# EAGLE schematic ChronoCape (EAGLE 7.5.0)
REV: A

## Sheet 1 of 2
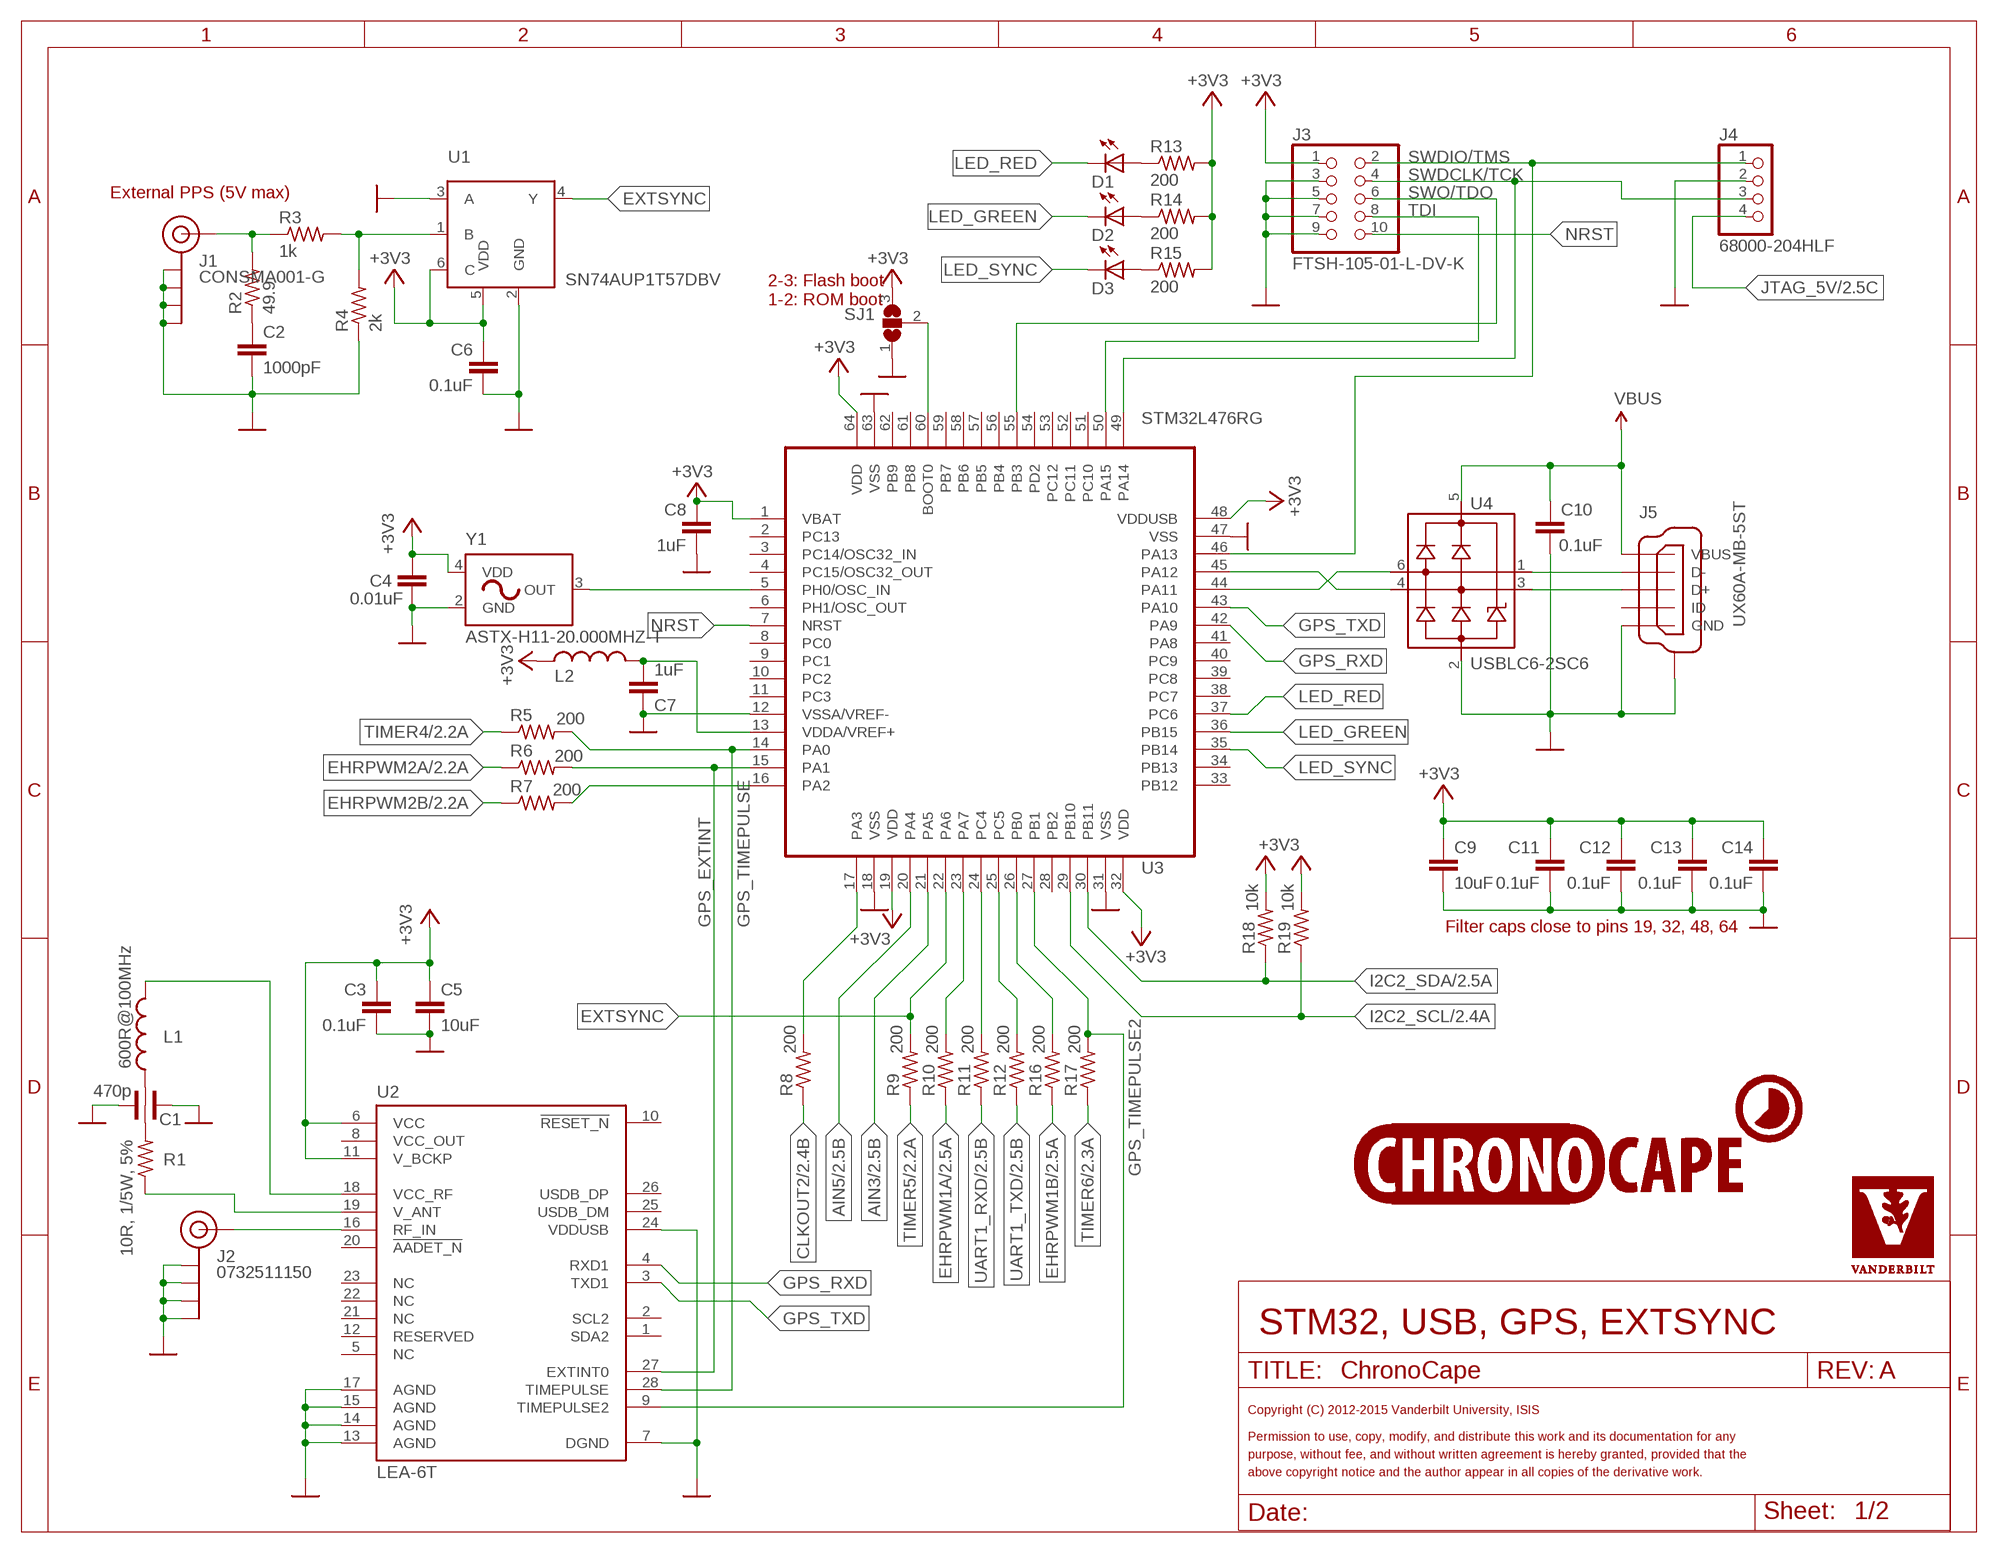
[diagram p0: schematic, sheet 1]

### Parts
C1  470p  CTHROUGH0805  [CTHROUGH0805]
C2  1000pF  C0603  [CHIP0603]
C3  0.1uF  C0603  [CHIP0603]
C4  0.01uF  C0603  [CHIP0603]
C5  10uF  C0805  [CHIP0805]
C6  0.1uF  C0603  [CHIP0603]
C7  1uF  C0603  [CHIP0603]
C8  1uF  C0603  [CHIP0603]
C9  10uF  C0805  [CHIP0805]
C10  0.1uF  C0603  [CHIP0603]
C11  0.1uF  C0603  [CHIP0603]
C12  0.1uF  C0603  [CHIP0603]
C13  0.1uF  C0603  [CHIP0603]
C14  0.1uF  C0603  [CHIP0603]
D1  598-8010-107F  LED0603  [D0603]
D2  598-8070-107F  LED0603  [D0603]
D3  598-8030-107F  LED0603  [D0603]
J1  CONSMA001-G  SMA_THROUGH  [SMA-THROUGH]
J2  0732511150  SMA_EDGE  [SMA-EDGE]
J3  FTSH-105-01-L-DV-K  [FTSH-105-01-L-DV-K]
J4  68000-204HLF  PINHD-1X4  [1X04]
J5  UX60A-MB-5ST  [UX60A-MB-5ST]
L1  600R@100MHz  L0603  [CHIP0603]
L2  BKP1608HS330  L0603  [CHIP0603]
LOGO1  LOGO_CHRONOCAPE  [LOGO_CHRONOSCAPE]
LOGO2  LOGO_VANDERBILT280MIL  [LOGO_VANDERBILT_280MIL]
R1  10R, 1/5W, 5%  R0603  [CHIP0603]
R2  49.9  R0603  [CHIP0603]
R3  1k  R0603  [CHIP0603]
R4  2k  R0603  [CHIP0603]
R5  200  R0603  [CHIP0603]
R6  200  R0603  [CHIP0603]
R7  200  R0603  [CHIP0603]
R8  200  R0603  [CHIP0603]
R9  200  R0603  [CHIP0603]
R10  200  R0603  [CHIP0603]
R11  200  R0603  [CHIP0603]
R12  200  R0603  [CHIP0603]
R13  200  R0603  [CHIP0603]
R14  200  R0603  [CHIP0603]
R15  200  R0603  [CHIP0603]
R16  200  R0603  [CHIP0603]
R17  200  R0603  [CHIP0603]
R18  10k  R0603  [CHIP0603]
R19  10k  R0603  [CHIP0603]
SJ1  SOLDERJUMPER_2WAYPASTE1&2  [SJ_3_PASTE1&2]
U1  SN74AUP1T57DBV  [SOT23-6]
U2  LEA-6T  [LEA-6]
U3  STM32L476RG  [LQFP64]
U4  USBLC6-2SC6  [SOT23-6L]
Y1  ASTX-H11-20.000MHZ-T  OSC_ASTX-H11  [SMD_3.2X2.5]

### Nets
+3V3 [power]: C3.1 C4.1 C5.1 C6.1 C8.1 C9.1 C11.1 C12.1 C13.1 C14.1 J3.1 L2.2 R13.2 R14.2 R15.2 R18.2 R19.2 SJ1.3 U1.5(VDD) U1.6(C) U2.6(VCC) U2.11(V_BCKP) U3.1(VBAT) U3.19(VDD) U3.32(VDD) U3.48(VDDUSB) U3.64(VDD) Y1.4(VDD) ; also sheet 2
AIN3: U3.21(PA5) ; also sheet 2
AIN5: U3.20(PA4) ; also sheet 2
CLKOUT2: R8.1 ; also sheet 2
EHRPWM1A: R10.1 ; also sheet 2
EHRPWM1B: R16.1 ; also sheet 2
EHRPWM2A: R6.1 ; also sheet 2
EHRPWM2B: R7.1 ; also sheet 2
EXTSYNC: R9.2 U1.4(Y) U3.22(PA6)
GND [power]: C1.GND$1(GND) C1.GND$2(GND) C2.2 C3.2 C4.2 C5.2 C6.2 C7.1 C8.2 C9.2 C10.2 C11.2 C12.2 C13.2 C14.2 J1.GND@0(GND) J1.GND@1(GND) J1.GND@2(GND) J1.GND@3(GND) J2.GND@0(GND) J2.GND@1(GND) J2.GND@2(GND) J2.GND@3(GND) J3.3 J3.5 J3.7 J3.9 J4.2 J5.5(GND) J5.SHLD@1(SHLD) J5.SHLD@2(SHLD) J5.SHLD@3(SHLD) J5.SHLD@4(SHLD) R4.1 SJ1.1 U1.2(GND) U1.3(A) U2.7(DGND) U2.13(AGND) U2.14(AGND) U2.15(AGND) U2.17(AGND) U2.24(VDDUSB) U3.12(VSSA/VREF-) U3.18(VSS) U3.31(VSS) U3.47(VSS) U3.63(VSS) U4.2(GND) Y1.2(GND) ; also sheet 2
GPS_EXTINT: R6.2 U2.27(EXTINT0) U3.15(PA1)
GPS_RXD: U2.4(RXD1) U3.42(PA9)
GPS_TIMEPULSE: R5.2 U2.28(TIMEPULSE) U3.14(PA0)
GPS_TIMEPULSE2: R17.2 U2.9(TIMEPULSE2) U3.27(PB1)
GPS_TXD: U2.3(TXD1) U3.43(PA10)
I2C2_SCL: R19.1 U3.29(PB10) ; also sheet 2
I2C2_SDA: R18.1 U3.30(PB11) ; also sheet 2
JTAG_5V [power]: J4.4 ; also sheet 2
LED_GREEN: D2.1(C) U3.36(PB15)
LED_RED: D1.1(C) U3.37(PC6)
LED_SYNC: D3.1(C) U3.35(PB14)
N$1: C2.1 R2.1
N$2: J1.SIG(SIGNAL) R2.2 R3.1
N$3 [power]: C7.2 L2.1 U3.13(VDDA/VREF+)
N$4: R3.2 R4.2 U1.1(B)
N$6: D1.2(A) R13.1
N$7: D2.2(A) R14.1
N$8 [power]: L1.2 U2.18(VCC_RF)
N$10: D3.2(A) R15.1
N$11: J2.SIG(SIGNAL) U2.16(RF_IN)
N$12: C1.2 L1.1
N$13 [power]: R1.1 U2.19(V_ANT)
N$14: C1.1 R1.2
N$15: J5.2(D-) U4.1(IO1)
N$18: SJ1.2 U3.60(BOOT0)
N$24: J5.3(D+) U4.3(IO2)
N$28: R7.2 U3.16(PA2)
N$30: R10.2 U3.23(PA7)
N$31: R11.2 U3.24(PC4)
N$32: R12.2 U3.25(PC5)
N$33: R16.2 U3.26(PB0)
N$35: R8.2 U3.17(PA3)
NRST: J3.10 U3.7(NRST)
OUT: U3.5(PH0/OSC_IN) Y1.3(OUT)
SWDCLK/TCK: J3.4 J4.3 U3.49(PA14)
SWDIO/TMS: J3.2 J4.1 U3.46(PA13)
SWO/TDO: J3.6 U3.55(PB3)
TDI: J3.8 U3.50(PA15)
TIMER4: R5.1 ; also sheet 2
TIMER5: R9.1 ; also sheet 2
TIMER6: R17.1 ; also sheet 2
UART1_RXD: R11.1 ; also sheet 2
UART1_TXD: R12.1 ; also sheet 2
USB_DM: U3.44(PA11) U4.6(IO1)
USB_DP: U3.45(PA12) U4.4(IO2)
VBUS [power]: C10.1 J5.1(VBUS) U4.5(VBUS) ; also sheet 2
Unconnected: J5.4(ID) U2.1(SDA2) U2.2(SCL2) U2.5(NC) U2.10(!RESET_N) U2.12(RESERVED) U2.20(!AADET_N) U2.21(NC) U2.22(NC) U2.23(NC) U2.25(USDB_DM) U2.26(USDB_DP) U3.2(PC13) U3.3(PC14/OSC32_IN) U3.4(PC15/OSC32_OUT) U3.6(PH1/OSC_OUT) U3.8(PC0) U3.9(PC1) U3.10(PC2) U3.11(PC3) U3.28(PB2) U3.33(PB12) U3.34(PB13) U3.38(PC7) U3.39(PC8) U3.40(PC9) U3.41(PA8) U3.51(PC10) U3.52(PC11) U3.53(PC12) U3.54(PD2) U3.56(PB4) U3.57(PB5) U3.58(PB6) U3.59(PB7) U3.61(PB8) U3.62(PB9)

### Notes on the sheet
- External PPS (5V max)
- 2-3: Flash boot
  1-2: ROM boot
- Filter caps close to pins 19, 32, 48, 64
- STM32, USB, GPS, EXTSYNC

## Sheet 2 of 2
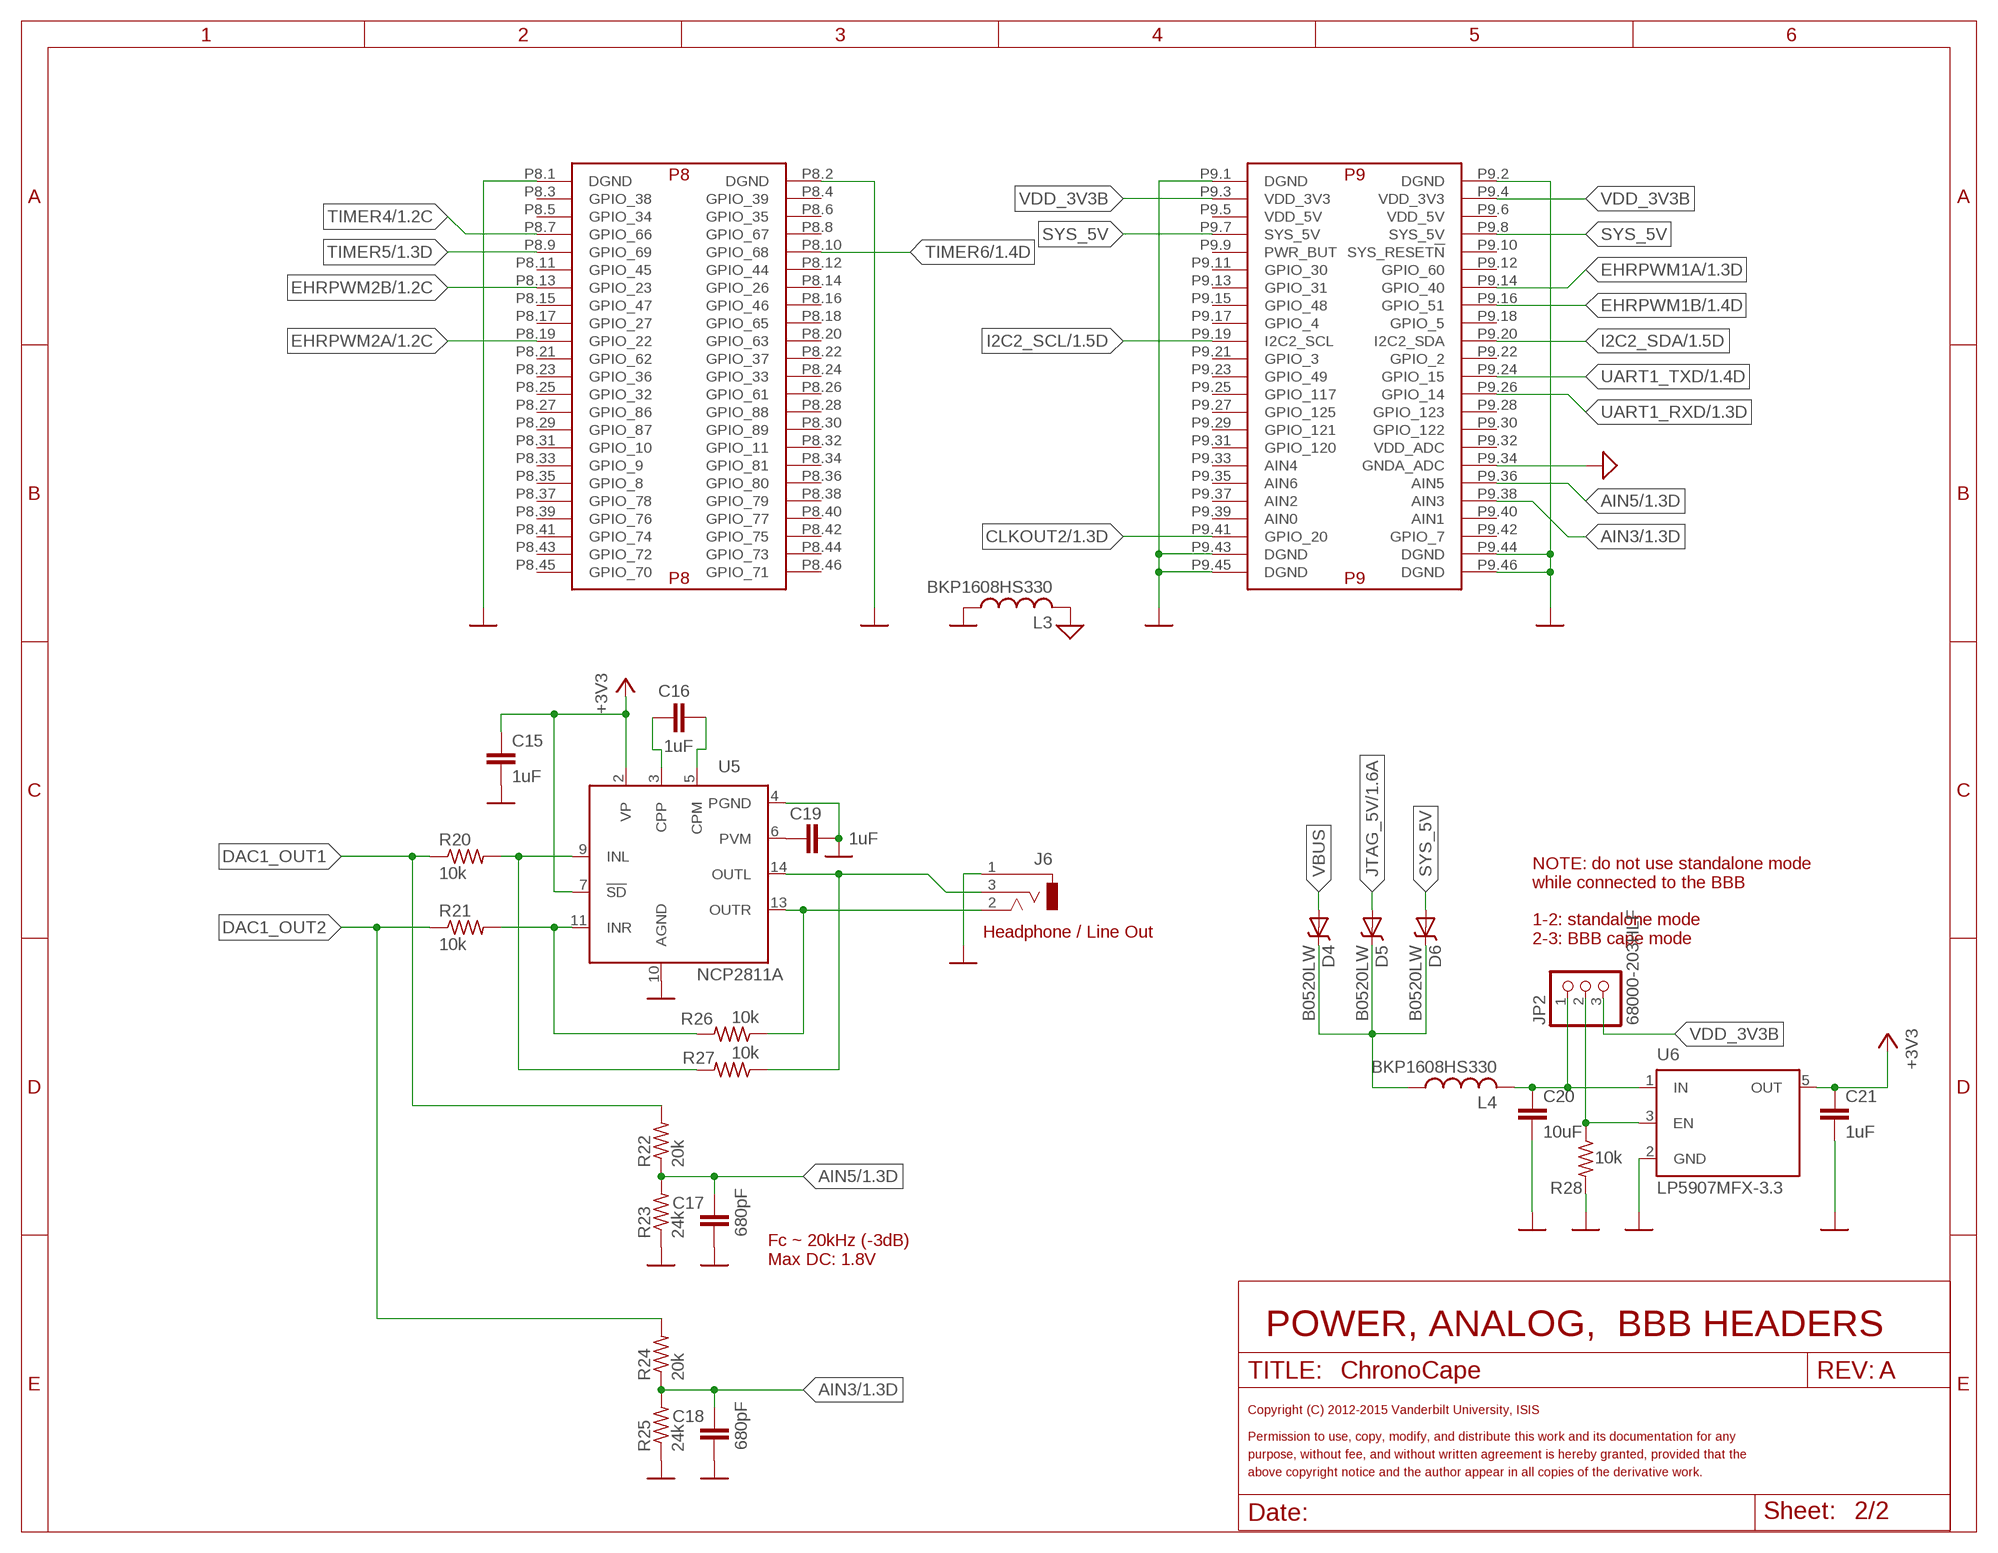
[diagram p1: schematic, sheet 2]

### Parts
BBB1  BEAGLE_BONE_BLACK_CAPE  [BEAGLE_BONE_BLACK_CAPE]
C15  1uF  C0603  [CHIP0603]
C16  1uF  C0603  [CHIP0603]
C17  680pF  C0603  [CHIP0603]
C18  680pF  C0603  [CHIP0603]
C19  1uF  C0603  [CHIP0603]
C20  10uF  C0805  [CHIP0805]
C21  1uF  C0603  [CHIP0603]
D4  B0520LW  DIODE-SCHOTTKYSOD-123  [SOD-123]
D5  B0520LW  DIODE-SCHOTTKYSOD-123  [SOD-123]
D6  B0520LW  DIODE-SCHOTTKYSOD-123  [SOD-123]
J6  CON_STEREO_JACK_SJ-3523-SMT  [SJ-3523-SMT]
JP2  68000-203HLF  PINHD-1X3  [1X03]
L3  BKP1608HS330  L0603  [CHIP0603]
L4  BKP1608HS330  L0603  [CHIP0603]
R20  10k  R0603  [CHIP0603]
R21  10k  R0603  [CHIP0603]
R22  20k  R0603  [CHIP0603]
R23  24k  R0603  [CHIP0603]
R24  20k  R0603  [CHIP0603]
R25  24k  R0603  [CHIP0603]
R26  10k  R0603  [CHIP0603]
R27  10k  R0603  [CHIP0603]
R28  10k  R0603  [CHIP0603]
U5  NCP2811A  [TSSOP14]
U6  LP5907MFX-3.3  LP5907MFX  [SOT23-5]

### Nets
+3V3 [power]: C15.1 C21.1 U5.2(VP) U5.7(!SD) U6.5(OUT) ; also sheet 1
AGND [power]: BBB1.P9.34(P9:GNDA_ADC) L3.2
AIN3: BBB1.P9.38(P9:AIN3) C18.1 R24.1 R25.2 ; also sheet 1
AIN5: BBB1.P9.36(P9:AIN5) C17.1 R22.1 R23.2 ; also sheet 1
CLKOUT2: BBB1.P9.41(P9:GPIO_20) ; also sheet 1
DAC1_OUT1: R20.1 R22.2
DAC1_OUT2: R21.1 R24.2
EHRPWM1A: BBB1.P9.14(P9:GPIO_40) ; also sheet 1
EHRPWM1B: BBB1.P9.16(P9:GPIO_51) ; also sheet 1
EHRPWM2A: BBB1.P8.19(P8:GPIO_22) ; also sheet 1
EHRPWM2B: BBB1.P8.13(P8:GPIO_23) ; also sheet 1
GND [power]: BBB1.P8.1(P8:DGND) BBB1.P8.2(P8:DGND) BBB1.P9.1(P9:DGND) BBB1.P9.2(P9:DGND) BBB1.P9.43(P9:DGND) BBB1.P9.44(P9:DGND) BBB1.P9.45(P9:DGND) BBB1.P9.46(P9:DGND) C15.2 C17.2 C18.2 C19.2 C20.2 C21.2 J6.1 L3.1 R23.1 R25.1 R28.2 U5.4(PGND) U5.10(AGND) U6.2(GND) ; also sheet 1
I2C2_SCL: BBB1.P9.19(P9:I2C2_SCL) ; also sheet 1
I2C2_SDA: BBB1.P9.20(P9:I2C2_SDA) ; also sheet 1
JTAG_5V [power]: D5.A ; also sheet 1
N$5 [power]: C20.1 JP2.1 L4.2 U6.1(IN)
N$9 [power]: D4.C D5.C D6.C L4.1
N$19: C16.1 U5.3(CPP)
N$20: C16.2 U5.5(CPM)
N$21: J6.2 R26.1 U5.13(OUTR)
N$22: R20.2 R27.2 U5.9(INL)
N$23: R21.2 R26.2 U5.11(INR)
N$25: J6.3 R27.1 U5.14(OUTL)
PVM: C19.1 U5.6(PVM)
PWR_EN: JP2.2 R28.1 U6.3(EN)
SYS_5V [power]: BBB1.P9.7(P9:SYS_5V) BBB1.P9.8(P9:SYS_5V) D6.A
TIMER4: BBB1.P8.7(P8:GPIO_66) ; also sheet 1
TIMER5: BBB1.P8.9(P8:GPIO_69) ; also sheet 1
TIMER6: BBB1.P8.10(P8:GPIO_68) ; also sheet 1
UART1_RXD: BBB1.P9.26(P9:GPIO_14) ; also sheet 1
UART1_TXD: BBB1.P9.24(P9:GPIO_15) ; also sheet 1
VBUS [power]: D4.A ; also sheet 1
VDD_3V3B: BBB1.P9.3(P9:VDD_3V3) BBB1.P9.4(P9:VDD_3V3) JP2.3
Unconnected: BBB1.P8.3(P8:GPIO_38) BBB1.P8.4(P8:GPIO_39) BBB1.P8.5(P8:GPIO_34) BBB1.P8.6(P8:GPIO_35) BBB1.P8.8(P8:GPIO_67) BBB1.P8.11(P8:GPIO_45) BBB1.P8.12(P8:GPIO_44) BBB1.P8.14(P8:GPIO_26) BBB1.P8.15(P8:GPIO_47) BBB1.P8.16(P8:GPIO_46) BBB1.P8.17(P8:GPIO_27) BBB1.P8.18(P8:GPIO_65) BBB1.P8.20(P8:GPIO_63) BBB1.P8.21(P8:GPIO_62) BBB1.P8.22(P8:GPIO_37) BBB1.P8.23(P8:GPIO_36) BBB1.P8.24(P8:GPIO_33) BBB1.P8.25(P8:GPIO_32) BBB1.P8.26(P8:GPIO_61) BBB1.P8.27(P8:GPIO_86) BBB1.P8.28(P8:GPIO_88) BBB1.P8.29(P8:GPIO_87) BBB1.P8.30(P8:GPIO_89) BBB1.P8.31(P8:GPIO_10) BBB1.P8.32(P8:GPIO_11) BBB1.P8.33(P8:GPIO_9) BBB1.P8.34(P8:GPIO_81) BBB1.P8.35(P8:GPIO_8) BBB1.P8.36(P8:GPIO_80) BBB1.P8.37(P8:GPIO_78) BBB1.P8.38(P8:GPIO_79) BBB1.P8.39(P8:GPIO_76) BBB1.P8.40(P8:GPIO_77) BBB1.P8.41(P8:GPIO_74) BBB1.P8.42(P8:GPIO_75) BBB1.P8.43(P8:GPIO_72) BBB1.P8.44(P8:GPIO_73) BBB1.P8.45(P8:GPIO_70) BBB1.P8.46(P8:GPIO_71) BBB1.P9.5(P9:VDD_5V) BBB1.P9.6(P9:VDD_5V) BBB1.P9.9(P9:PWR_BUT) BBB1.P9.10(P9:SYS_RESET!N) BBB1.P9.11(P9:GPIO_30) BBB1.P9.12(P9:GPIO_60) BBB1.P9.13(P9:GPIO_31) BBB1.P9.15(P9:GPIO_48) BBB1.P9.17(P9:GPIO_4) BBB1.P9.18(P9:GPIO_5) BBB1.P9.21(P9:GPIO_3) BBB1.P9.22(P9:GPIO_2) BBB1.P9.23(P9:GPIO_49) BBB1.P9.25(P9:GPIO_117) BBB1.P9.27(P9:GPIO_125) BBB1.P9.28(P9:GPIO_123) BBB1.P9.29(P9:GPIO_121) BBB1.P9.30(P9:GPIO_122) BBB1.P9.31(P9:GPIO_120) BBB1.P9.32(P9:VDD_ADC) BBB1.P9.33(P9:AIN4) BBB1.P9.35(P9:AIN6) BBB1.P9.37(P9:AIN2) BBB1.P9.39(P9:AIN0) BBB1.P9.40(P9:AIN1) BBB1.P9.42(P9:GPIO_7)

### Notes on the sheet
- Headphone / Line Out
- NOTE: do not use standalone mode 
  while connected to the BBB
  
  1-2: standalone mode
  2-3: BBB cape mode
- Fc ~ 20kHz (-3dB)
  Max DC: 1.8V
- POWER, ANALOG,  BBB HEADERS

## Power pins joined to a net without a drawn wire
VCC_OUT: U2.8(VCC_OUT)

## Library data of the parts
BBB1 = EAGLENEST:BEAGLE_BONE_BLACK_CAPE
C1 = EAGLENEST:CTHROUGH: CTHROUGH Feed Through Chip capacitor
C2-C21 = EAGLENEST:C: CAPACITOR Typical parts: AVX Multilayer Capacitors <http://www.avx.com/docs/masterpubs/smccp.pdf>
D1-D3 = EAGLENEST:LED: LEDs Standard schematic elements and footprints for LEDs.
D4-D6 = EAGLENEST:DIODE-SCHOTTKY: SCHOTTKY DIODE
J1 J2 = EAGLENEST:SMA: SMA Antenna Connector End launch SMA connector. The paste layer has been removed so that the connector can be hand soldered onto the board after reflow.
J3 = EAGLENEST:FTSH-105: FTSH-105 Samtech FTSH series 50mil micro SMT header 2x5 pins
J4 = EAGLENEST:PINHD-1X4: PIN HEADER
J5 = EAGLENEST:UX60A-MB-5ST: MINI USB-B Conector Source: http://www.hirose.co.jp/cataloge_hp/e24000019.pdf
J6 = EAGLENEST:CON_STEREO_JACK: CON_STEREO_JACK Audio stereo jack, 3 conductors.
JP2 = EAGLENEST:PINHD-1X3: PIN HEADER
L1-L4 = EAGLENEST:L: INDUCTOR (coils and beads) Typical Parts: Murata Chip Ferrite Beads <http://www.murata.com/products/catalog/pdf/c31e.pdf>
LOGO1 = EAGLENEST:LOGO_CHRONOCAPE
LOGO2 = EAGLENEST:LOGO_VANDERBILT: LOGO_VANDERBILT Official Vanderbilt logo as of 2010 January.
R1-R28 = EAGLENEST:R: RESISTOR Typical parts: ROHM Resistors <http://www.rohm.com/products/databook/r/pdf/resistor_catalog.pdf>
SJ1 = EAGLENEST:SOLDERJUMPER_2WAY: Solder Jumper 2 way solder jumper
U1 = EAGLENEST:SN74AUP1T57: SN74AUP1T57 Single-Supply Voltage-Level Translator With Configurable Functions
U2 = EAGLENEST:LEA-6T: LEA-6T u-blox LEA-6T GPS Module <http://www.u-blox.com/images/downloads/Product_Docs/LEA-6_DataSheet_%28GPS.G6-HW-09004%29.pdf>
U3 = EAGLENEST:STM32L476RG: STM32L476RG ARM Cortex-M4F MCU in LQFP64
U4 = EAGLENEST:USBLC6-2: USBLC6-2 Very low capacitance ESD protection Source: http://www.st.com/internet/com/TECHNICAL_RESOURCES/TECHNICAL_LITERATURE/DATASHEET/CD00050750.pdf; DIGI-KEY#: 497-5235-1-ND; MF: STMicroelectronics; MPN: USBLC6-2SC6
U5 = EAGLENEST:NCP2811: NCP2811 NOCAP Advanced Stereo Headphone Amplifier ON Semiconductor
U6 = EAGLENEST:LP5907: Texas Instruments LP5907 ULTRA LOW-NOISE, 250-mA LINEAR REGULATOR FOR RF AND ANALOG CIRCUITS - REQUIRES NO BYPASS CAPACITOR
Y1 = EAGLENEST:OSC: Crsytal oscillator

## Net classes
0 default: width 0.152 mm, drill 0.33 mm, clearance 0.152 mm
1 power: width 0.254 mm, drill 0.33 mm, clearance 0.152 mm